# EAGLE schematic DevBoard_v0.1 (EAGLE 9.1.3)

## Sheet 1 of 11: STM32F1
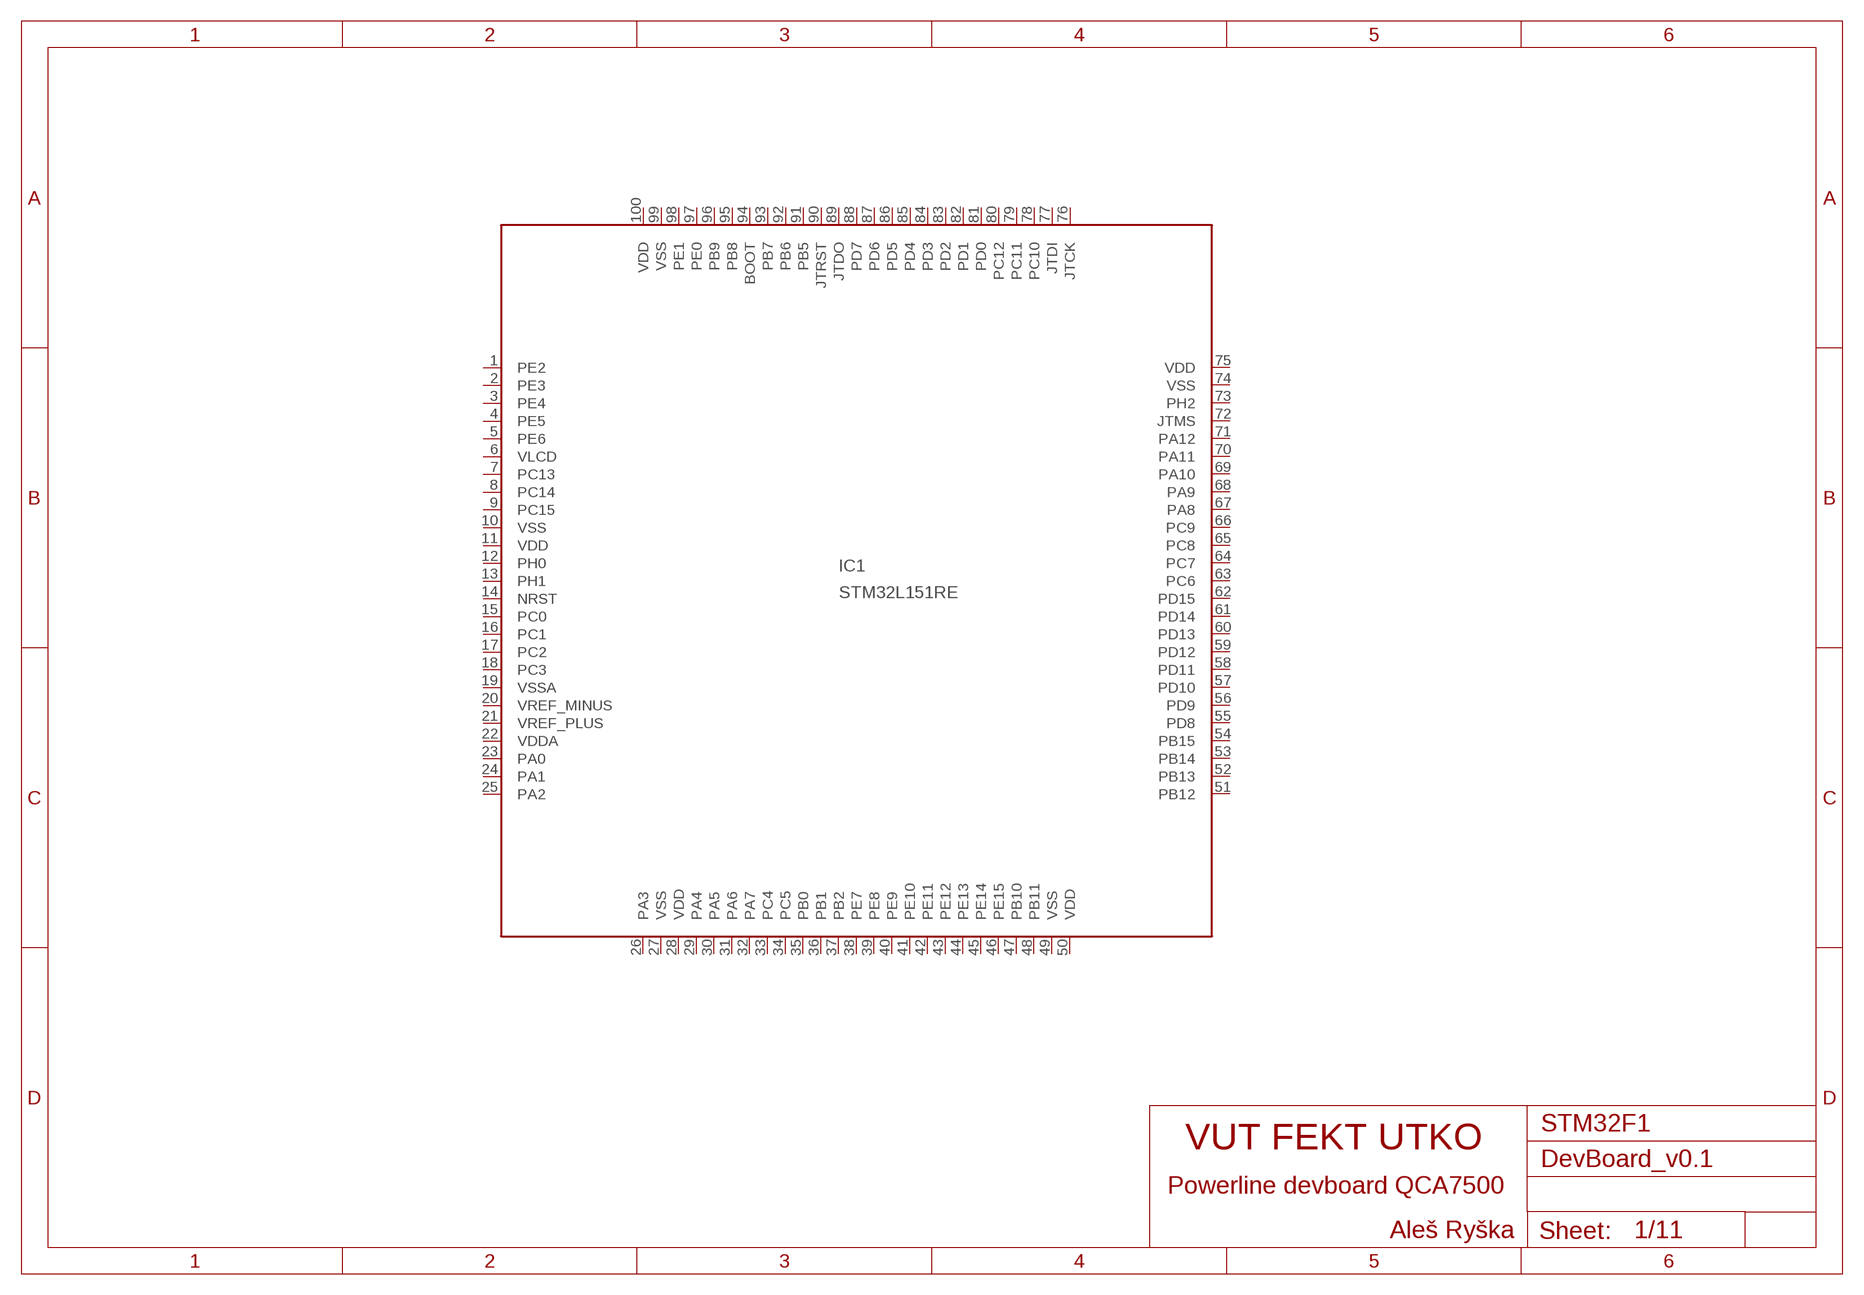
[diagram p0: schematic, sheet 1]

### Parts
IC1  STM32L151RE  [LQFP100_14X14]
Unconnected: IC1.1(PE2) IC1.2(PE3) IC1.3(PE4) IC1.4(PE5) IC1.5(PE6) IC1.6(VLCD) IC1.7(PC13) IC1.8(PC14) IC1.9(PC15) IC1.12(PH0) IC1.13(PH1) IC1.14(NRST) IC1.15(PC0) IC1.16(PC1) IC1.17(PC2) IC1.18(PC3) IC1.20(VREF_MINUS) IC1.21(VREF_PLUS) IC1.23(PA0) IC1.24(PA1) IC1.25(PA2) IC1.26(PA3) IC1.29(PA4) IC1.30(PA5) IC1.31(PA6) IC1.32(PA7) IC1.33(PC4) IC1.34(PC5) IC1.35(PB0) IC1.36(PB1) IC1.37(PB2) IC1.38(PE7) IC1.39(PE8) IC1.40(PE9) IC1.41(PE10) IC1.42(PE11) IC1.43(PE12) IC1.44(PE13) IC1.45(PE14) IC1.46(PE15) IC1.47(PB10) IC1.48(PB11) IC1.51(PB12) IC1.52(PB13) IC1.53(PB14) IC1.54(PB15) IC1.55(PD8) IC1.56(PD9) IC1.57(PD10) IC1.58(PD11) IC1.59(PD12) IC1.60(PD13) IC1.61(PD14) IC1.62(PD15) IC1.63(PC6) IC1.64(PC7) IC1.65(PC8) IC1.66(PC9) IC1.67(PA8) IC1.68(PA9) IC1.69(PA10) IC1.70(PA11) IC1.71(PA12) IC1.72(JTMS) IC1.73(PH2) IC1.76(JTCK) IC1.77(JTDI) IC1.78(PC10) IC1.79(PC11) IC1.80(PC12) IC1.81(PD0) IC1.82(PD1) IC1.83(PD2) IC1.84(PD3) IC1.85(PD4) IC1.86(PD5) IC1.87(PD6) IC1.88(PD7) IC1.89(JTDO) IC1.90(JTRST) IC1.91(PB5) IC1.92(PB6) IC1.93(PB7) IC1.94(BOOT) IC1.95(PB8) IC1.96(PB9) IC1.97(PE0) IC1.98(PE1)

### Notes on the sheet
- STM32F1
- VUT FEKT UTKO
- Powerline devboard QCA7500
- Aleš Ryška

## Sheet 2 of 11: RS485
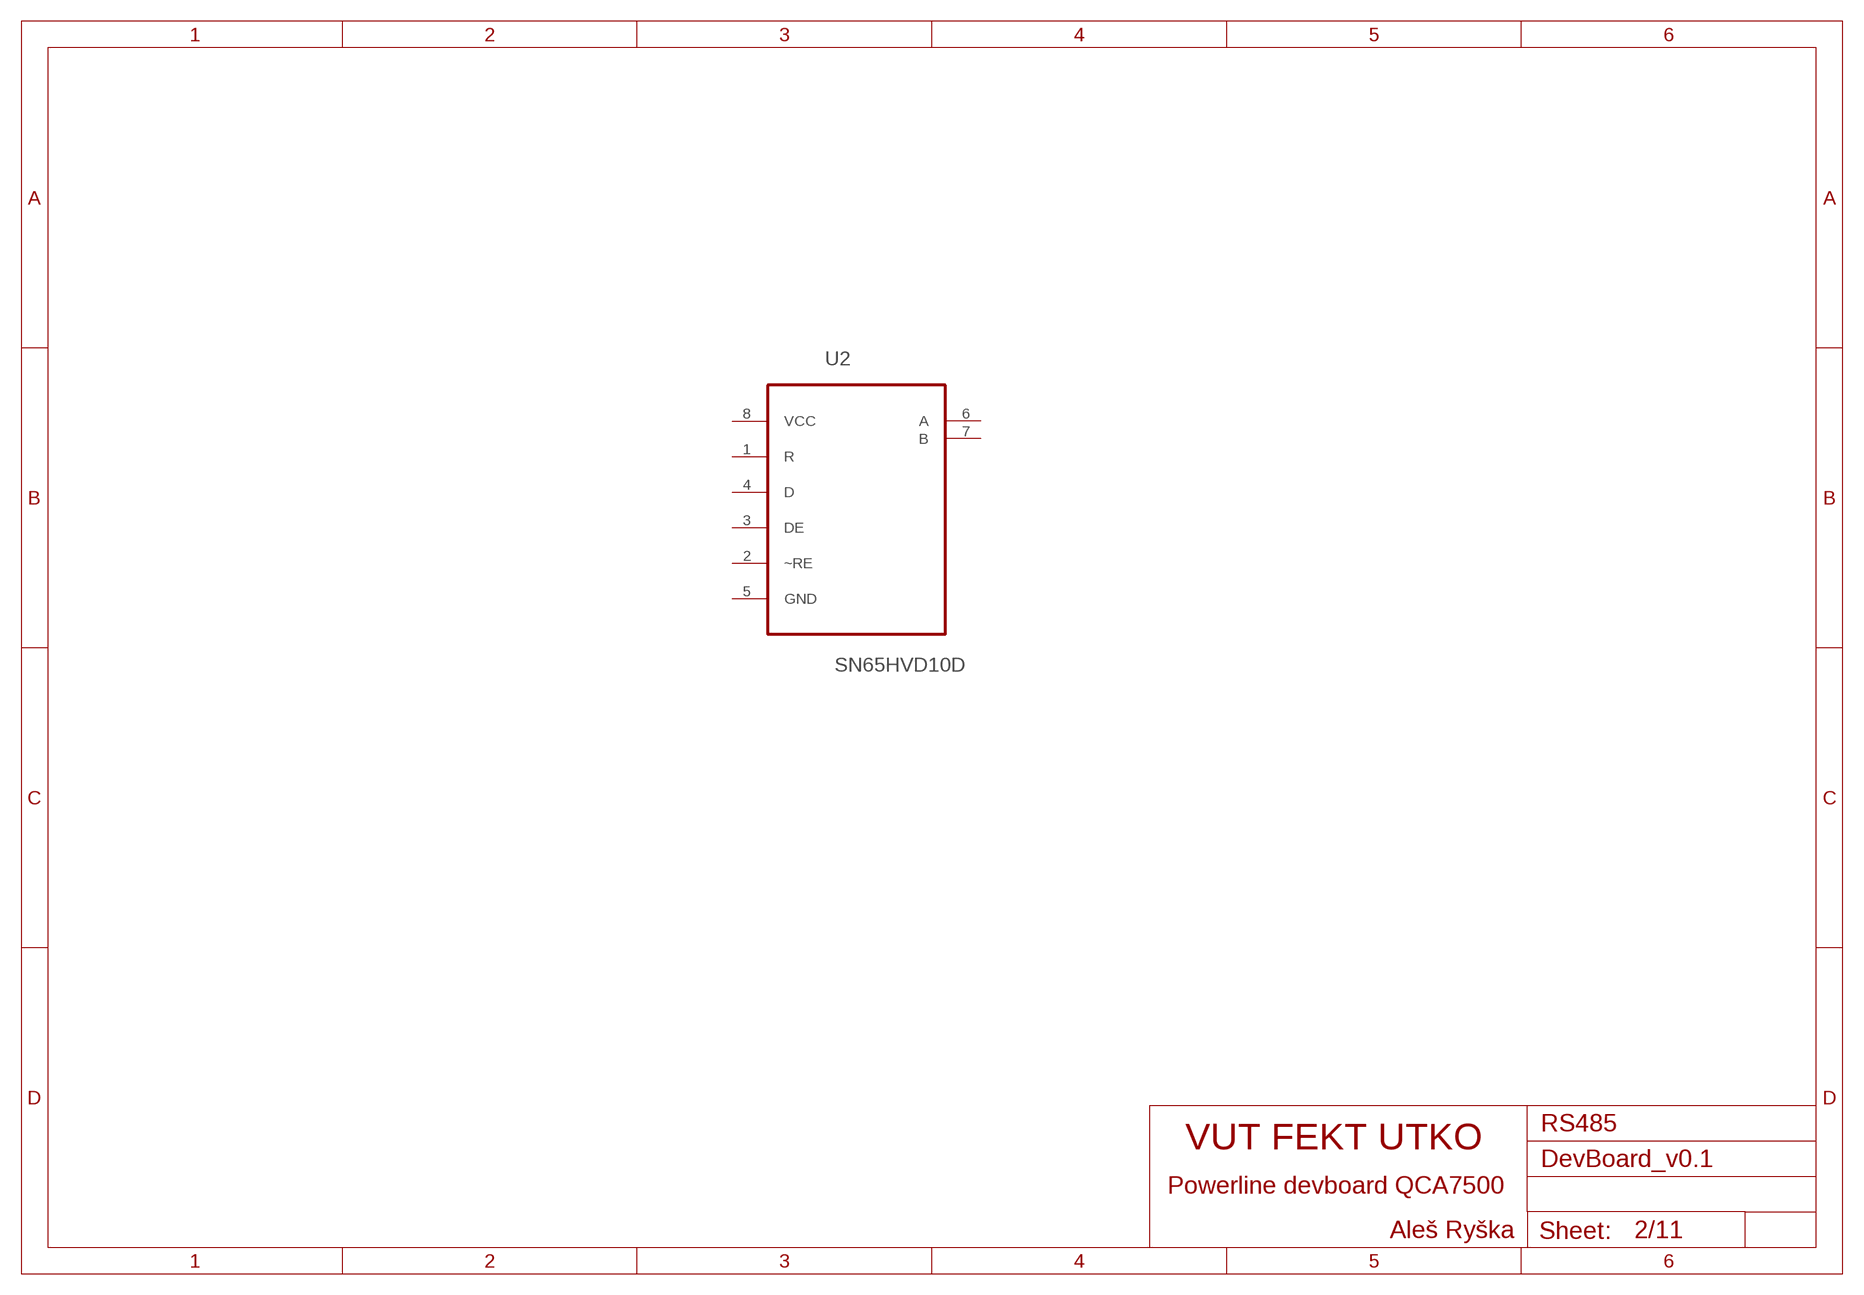
[diagram p1: schematic, sheet 2]

### Parts
U2  SN65HVD10D  [SOIC127P600X175-8N]
Unconnected: U2.1(R) U2.2(~RE) U2.3(DE) U2.4(D) U2.5(GND) U2.6(A) U2.7(B)

### Notes on the sheet
- RS485
- VUT FEKT UTKO
- Powerline devboard QCA7500
- Aleš Ryška

## Sheet 3 of 11: CAN
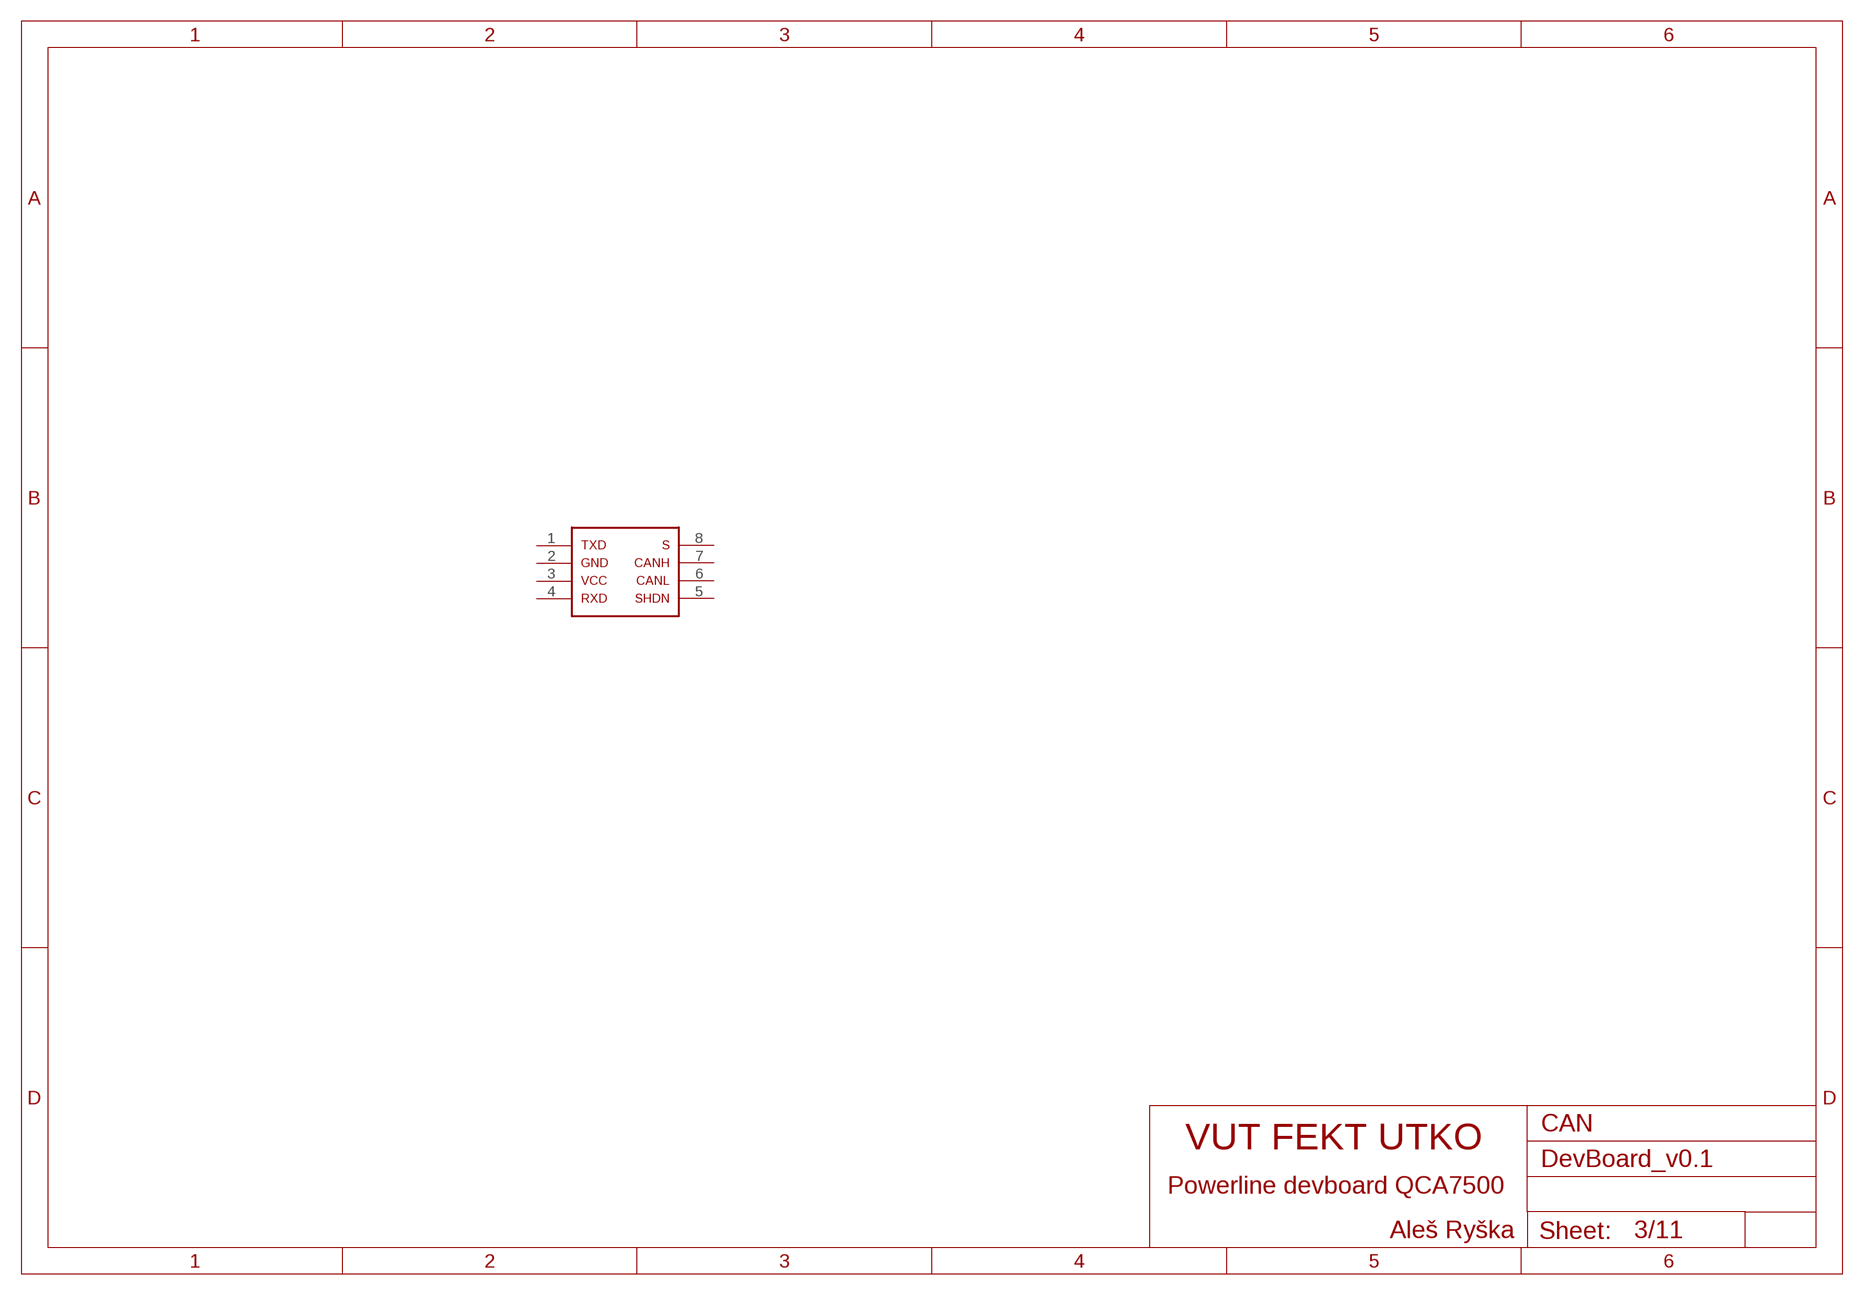
[diagram p2: schematic, sheet 3]

### Parts
U$2  TCAN330  [SOP65P280X145-8N]
Unconnected: U$2.1(TXD) U$2.2 U$2.3 U$2.4(RXD) U$2.5(SHDN) U$2.6(CANL) U$2.7(CANH) U$2.8(S)

### Notes on the sheet
- CAN
- VUT FEKT UTKO
- Powerline devboard QCA7500
- Aleš Ryška

## Sheet 4 of 11: GPIO & SW
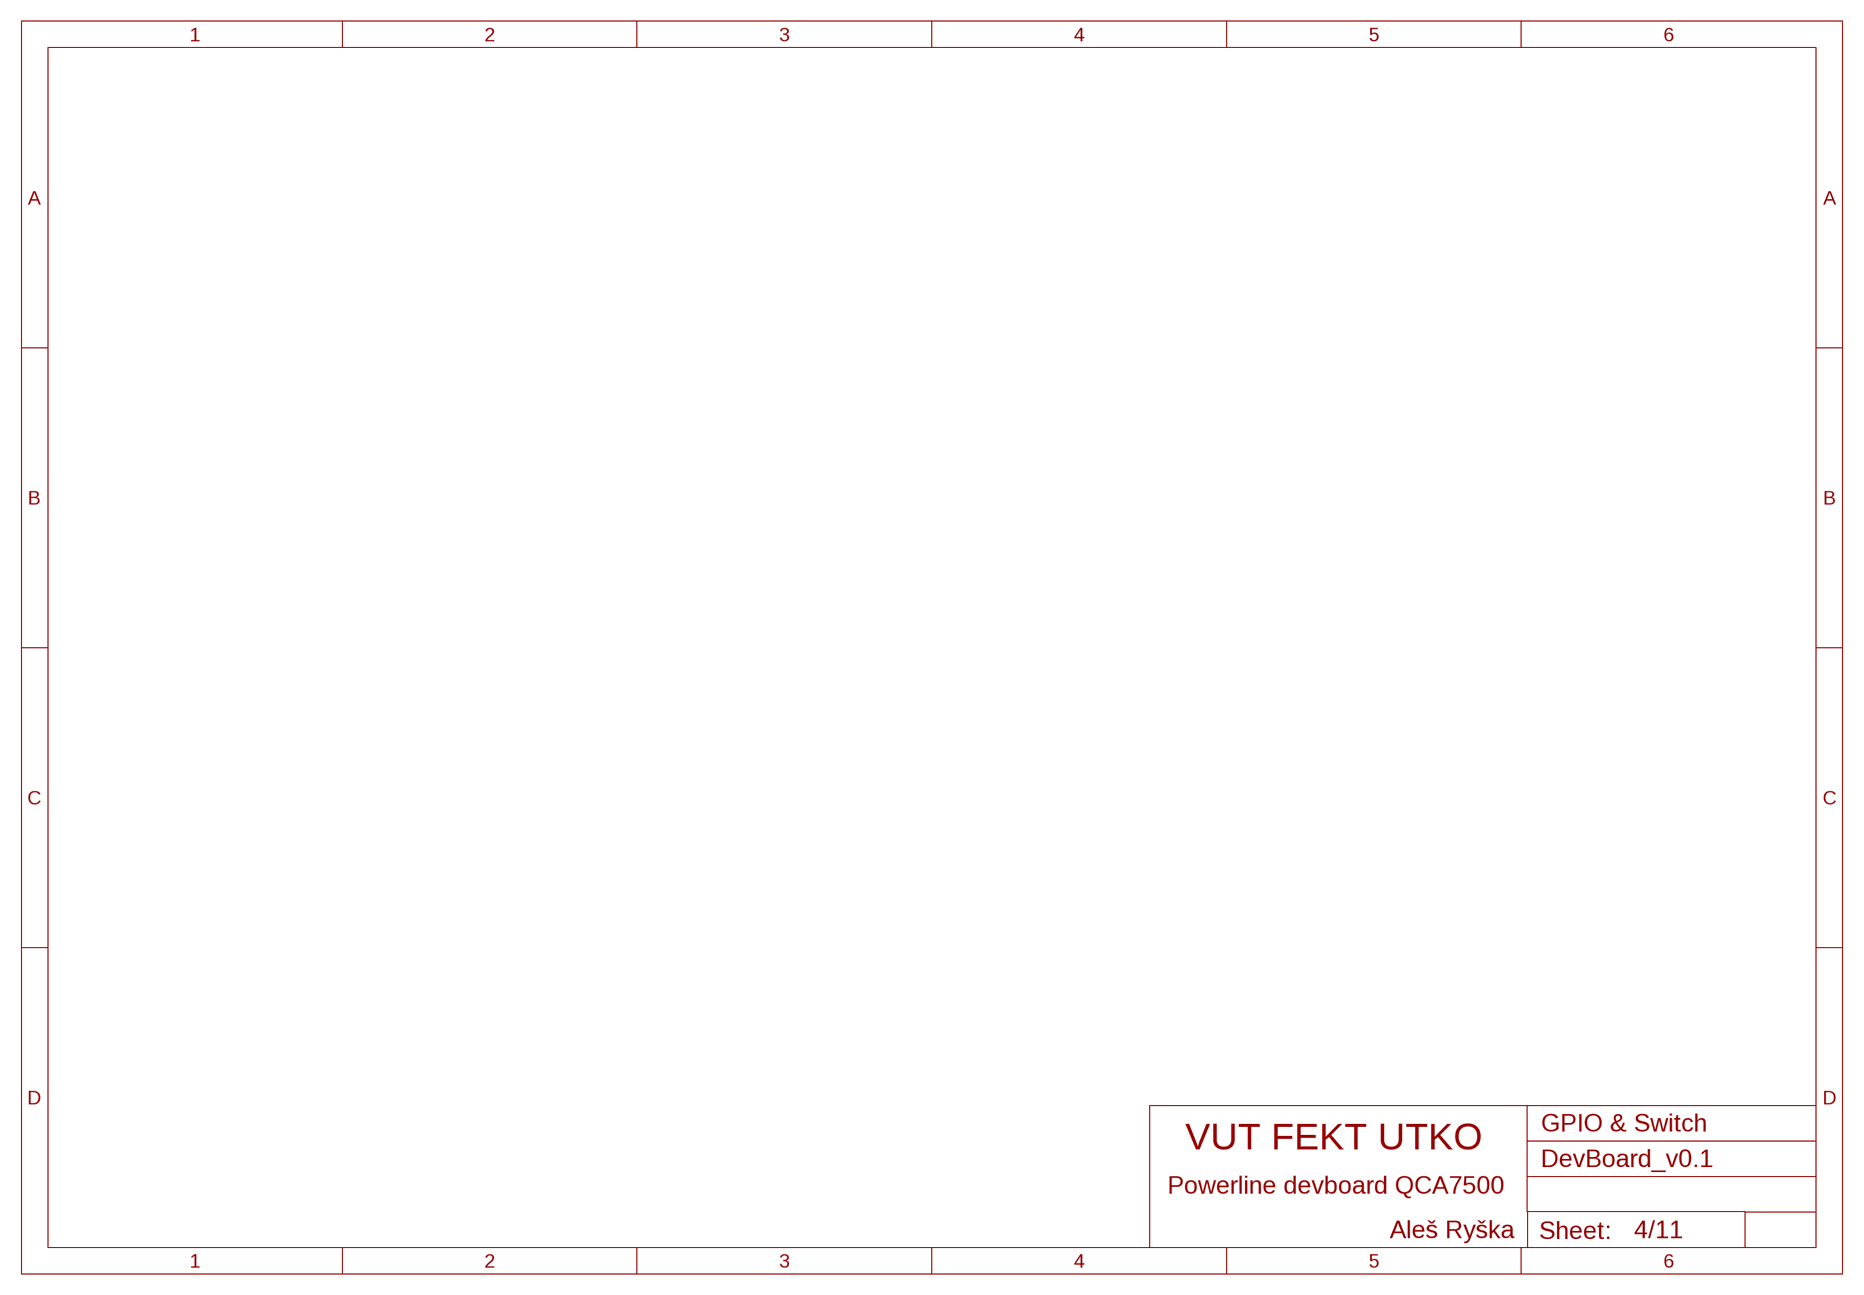
[diagram p3: schematic, sheet 4]

### Notes on the sheet
- GPIO & Switch
- VUT FEKT UTKO
- Powerline devboard QCA7500
- Aleš Ryška

## Sheet 5 of 11: Supply
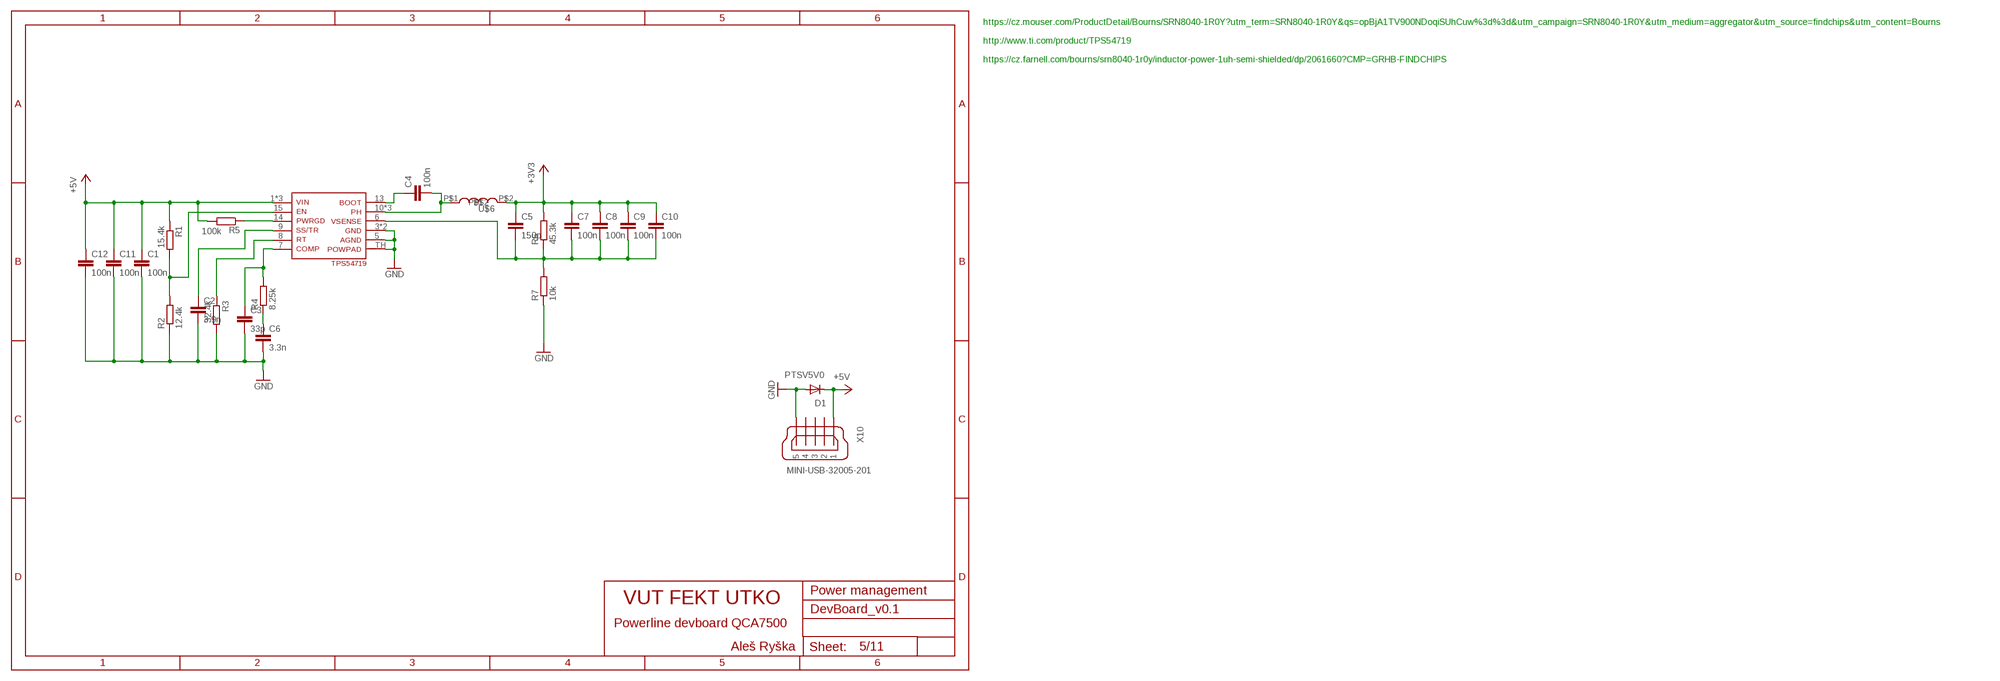
[diagram p4: schematic, sheet 5]

### Parts
C1  100n  C-EUC0805  [C0805]
C2  3.9n  C-EUC0805  [C0805]
C3  33p  C-EUC0805  [C0805]
C4  100n  C-EUC0805  [C0805]
C5  150p  C-EUC0805  [C0805]
C6  3.3n  C-EUC0805  [C0805]
C7  100n  C-EUC0805  [C0805]
C8  100n  C-EUC0805  [C0805]
C9  100n  C-EUC0805  [C0805]
C10  100n  C-EUC0805  [C0805]
C11  100n  C-EUC0805  [C0805]
C12  100n  C-EUC0805  [C0805]
D1  PTSV5V0  DIODE-SOD123  [SOD123]
R1  15.4k  R-EU_R0603  [R0603]
R2  12.4k  R-EU_R0603  [R0603]
R3  32.4k  R-EU_R0603  [R0603]
R4  8.25k  R-EU_R0603  [R0603]
R5  100k  R-EU_R0603  [R0603]
R6  45.3k  R-EU_R0603  [R0603]
R7  10k  R-EU_R0603  [R0603]
U$3  TPS54719  [QFN16]
U$6  1u  SRN8040  [SRN8040]
X10  MINI-USB-32005-201  [32005-201]

### Nets
+3V3: C5.1 C7.1 C8.1 C9.1 C10.1 R6.2 U$6.P$2 ; also sheet 6
+5V: C1.1 C11.1 C12.1 D1.C R1.1 R5.2 U$3.1(V_IN) U$3.2(V_IN) U$3.16(V_IN) X10.1
GND: C1.2 C2.2 C3.2 C6.2 C11.2 C12.2 D1.A R2.1 R3.2 R7.1 U$3.3(GND) U$3.4(GND) U$3.5(AGND) U$3.TH(PPAD) X10.5 ; also sheet 6,11
N$2: R1.2 R2.2 U$3.15(EN)
N$3: C2.1 U$3.9(SS/TR)
N$4: R3.1 U$3.8(RT)
N$5: C3.1 R4.2 U$3.7(COMP)
N$6: R5.1 U$3.14(PWRGD)
N$7: C6.1 R4.1
N$8: C4.1 U$3.13(BOOT)
N$9: C4.2 U$3.10(PH) U$3.11(PH) U$3.12(PH) U$6.P$1
N$12: C5.2 C7.2 C8.2 C9.2 C10.2 R6.1 R7.2 U$3.6(VSNS)
Unconnected: X10.2 X10.3 X10.4

### Notes on the sheet
- https://cz.mouser.com/ProductDetail/Bourns/SRN8040-1R0Y?utm_term=SRN8040-1R0Y&qs=opBjA1TV900NDoqiSUhCuw%3d%3d&utm_campaign=SRN8040-1R0Y&utm_medium=aggregator&utm_source=findchips&utm_content=Bourns
- http://www.ti.com/product/TPS54719
- https://cz.farnell.com/bourns/srn8040-1r0y/inductor-power-1uh-semi-shielded/dp/2061660?CMP=GRHB-FINDCHIPS
- Power management
- VUT FEKT UTKO
- Powerline devboard QCA7500
- Aleš Ryška

## Sheet 6 of 11: Jalapeno
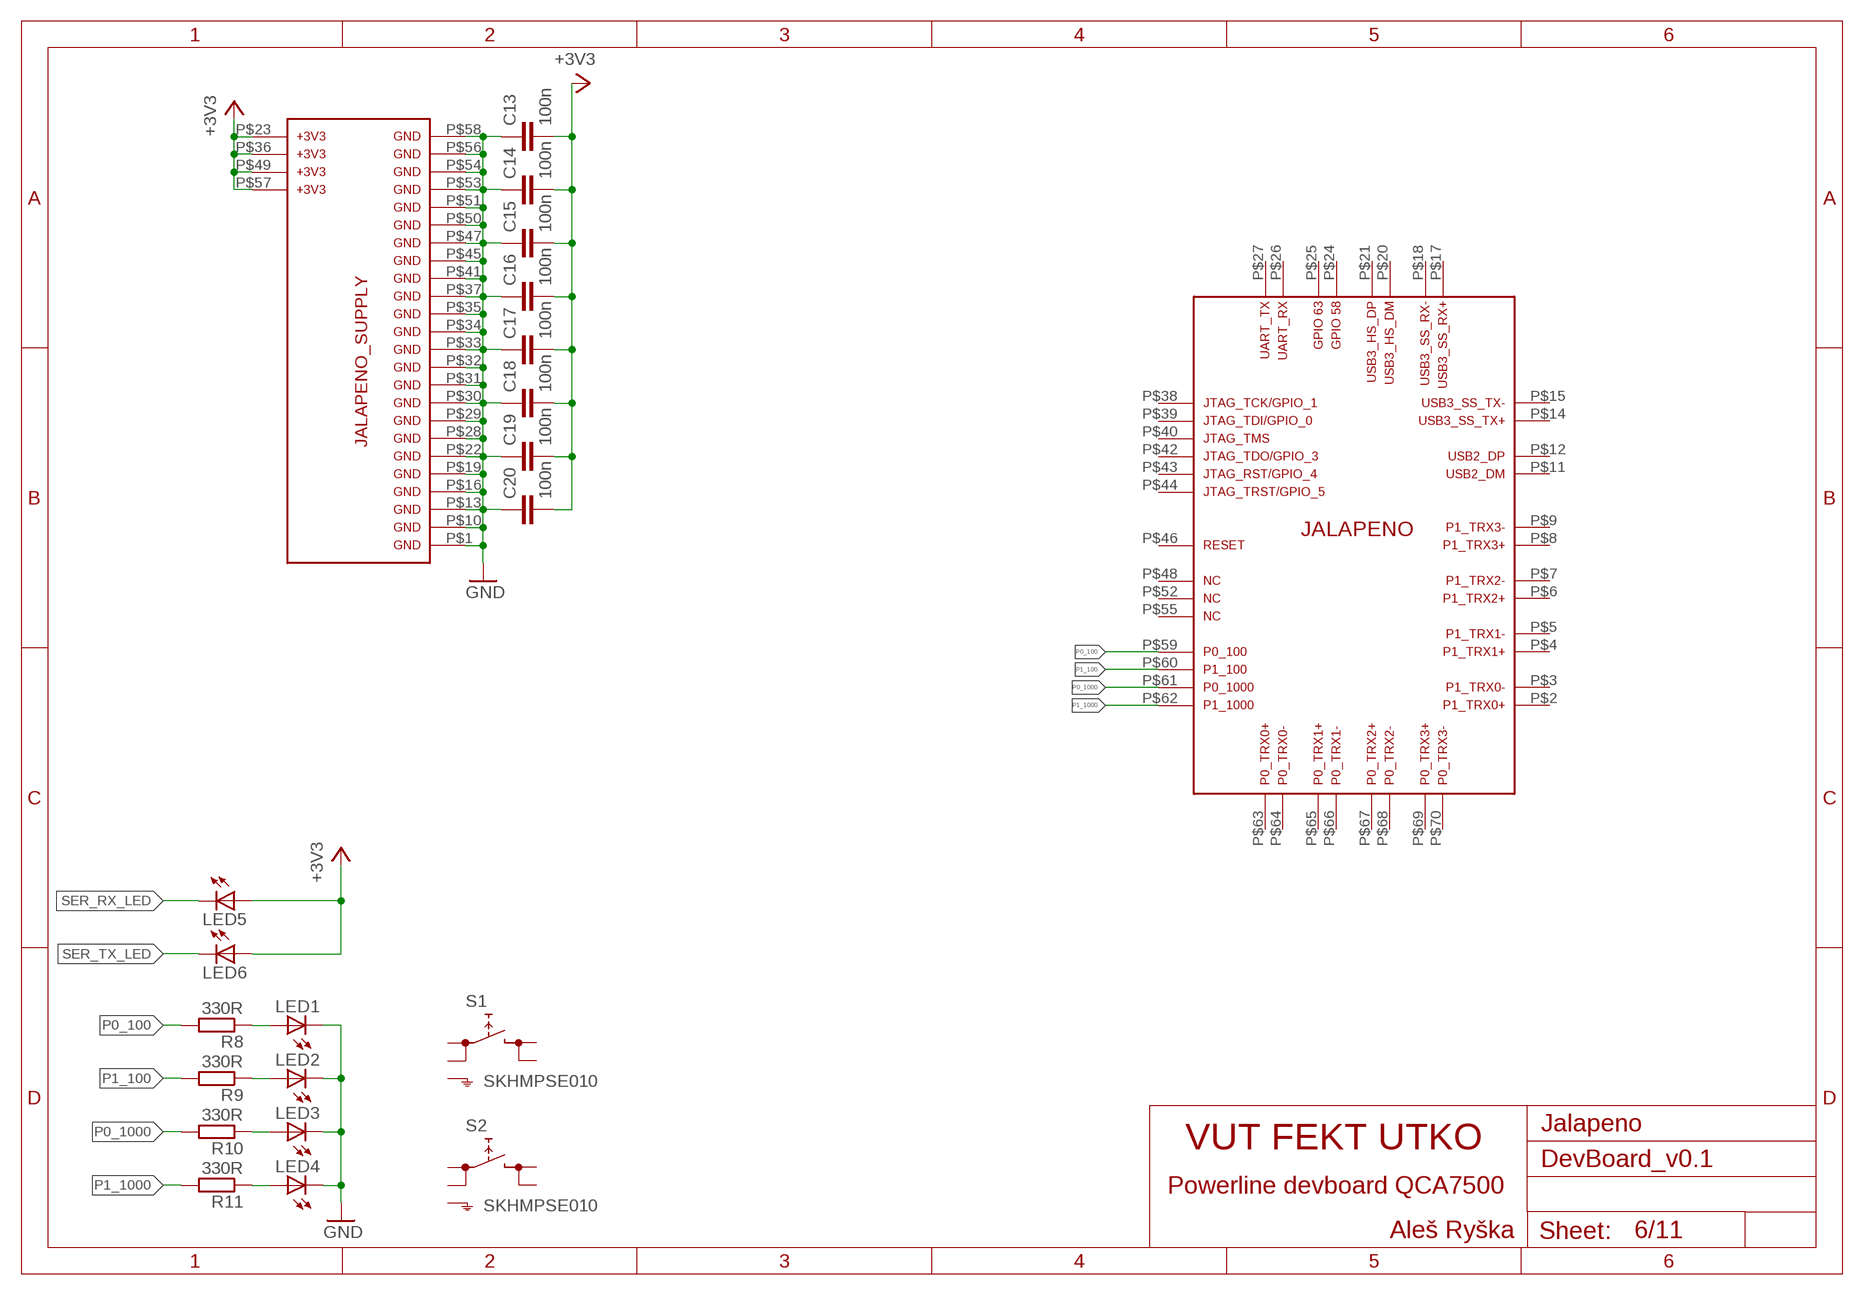
[diagram p5: schematic, sheet 6]

### Parts
C13  100n  C-EUC0805  [C0805]
C14  100n  C-EUC0805  [C0805]
C15  100n  C-EUC0805  [C0805]
C16  100n  C-EUC0805  [C0805]
C17  100n  C-EUC0805  [C0805]
C18  100n  C-EUC0805  [C0805]
C19  100n  C-EUC0805  [C0805]
C20  100n  C-EUC0805  [C0805]
LED1  LED_E  [LED_1206]
LED2  LED_E  [LED_1206]
LED3  LED_E  [LED_1206]
LED4  LED_E  [LED_1206]
LED5  LED_E  [LED_1206]
LED6  LED_E  [LED_1206]
R8  330R  R-EU_R0603  [R0603]
R9  330R  R-EU_R0603  [R0603]
R10  330R  R-EU_R0603  [R0603]
R11  330R  R-EU_R0603  [R0603]
S1  SKHMPSE010  [SKHMPXE010]
S2  SKHMPSE010  [SKHMPXE010]
U$1  JALAPENO  [JALAPENO]

### Nets
+3V3: C13.2 C14.2 C15.2 C16.2 C17.2 C18.2 C19.2 C20.2 LED5.A LED6.A U$1.P$23 U$1.P$36 U$1.P$49 U$1.P$57 ; also sheet 5
GND: C13.1 C14.1 C15.1 C16.1 C17.1 C18.1 C19.1 C20.1 LED1.C LED2.C LED3.C LED4.C U$1.P$1 U$1.P$10 U$1.P$13 U$1.P$16 U$1.P$19 U$1.P$22 U$1.P$28 U$1.P$29 U$1.P$30 U$1.P$31 U$1.P$32 U$1.P$33 U$1.P$34 U$1.P$35 U$1.P$37 U$1.P$41 U$1.P$45 U$1.P$47 U$1.P$50 U$1.P$51 U$1.P$53 U$1.P$54 U$1.P$56 U$1.P$58 ; also sheet 5,11
N$10: LED1.A R8.1
N$11: LED2.A R9.1
N$13: LED3.A R10.1
N$14: LED4.A R11.1
P0_100: R8.2 U$1.P$59(P0_100)
P0_1000: R10.2 U$1.P$61(P0_1000)
P1_100: R9.2 U$1.P$60(P1_100)
P1_1000: R11.2 U$1.P$62(P1_1000)
SER_RX_LED: LED5.C
SER_TX_LED: LED6.C
Unconnected: S1.1(1.1) S1.2(1.2) S1.3(2.1) S1.4(2.2) S1.5(SH) S2.1(1.1) S2.2(1.2) S2.3(2.1) S2.4(2.2) S2.5(SH) U$1.P$2(P1_TRX0_P) U$1.P$3(P1_TRX0_N) U$1.P$4(P1_TRX1_P) U$1.P$5(P1_TRX1_N) U$1.P$6(P1_TRX2_P) U$1.P$7(P1_TRX2_N) U$1.P$8(P1_TRX3_P) U$1.P$9(P1_TRX3_N) U$1.P$11(USB2_DM) U$1.P$12(USB2_DP) U$1.P$14(USB3_SS_TX_P) U$1.P$15(USB3_SS_TX_N) U$1.P$17(USB3_SS_RX_P) U$1.P$18(USB3_SS_RX_N) U$1.P$20(USB3_HS_DM) U$1.P$21(USB3_HS_DP) U$1.P$24(GPIO_58) U$1.P$25(GPIO_63) U$1.P$26(UART_RX) U$1.P$27(UART_TX) U$1.P$38(JTAG_TCK) U$1.P$39(JTAG_TDI) U$1.P$40(JTAG_TMS) U$1.P$42(JTAG_TDO) U$1.P$43(JTAG_RST_N) U$1.P$44(JTAG_TRST_N) U$1.P$46(CHIP_PWD_L) U$1.P$48 U$1.P$52 U$1.P$55 U$1.P$63(P0_TRX0_P) U$1.P$64(P0_TRX0_N) U$1.P$65(P0_TRX1_P) U$1.P$66(P0_TRX1_N) U$1.P$67(P0_TRX2_P) U$1.P$68(P0_TRX2_N) U$1.P$69(P0_TRX3_P) U$1.P$70(P0_TRX3_N)

### Notes on the sheet
- Jalapeno
- VUT FEKT UTKO
- Powerline devboard QCA7500
- Aleš Ryška

## Sheet 7 of 11: Gigabit transciever
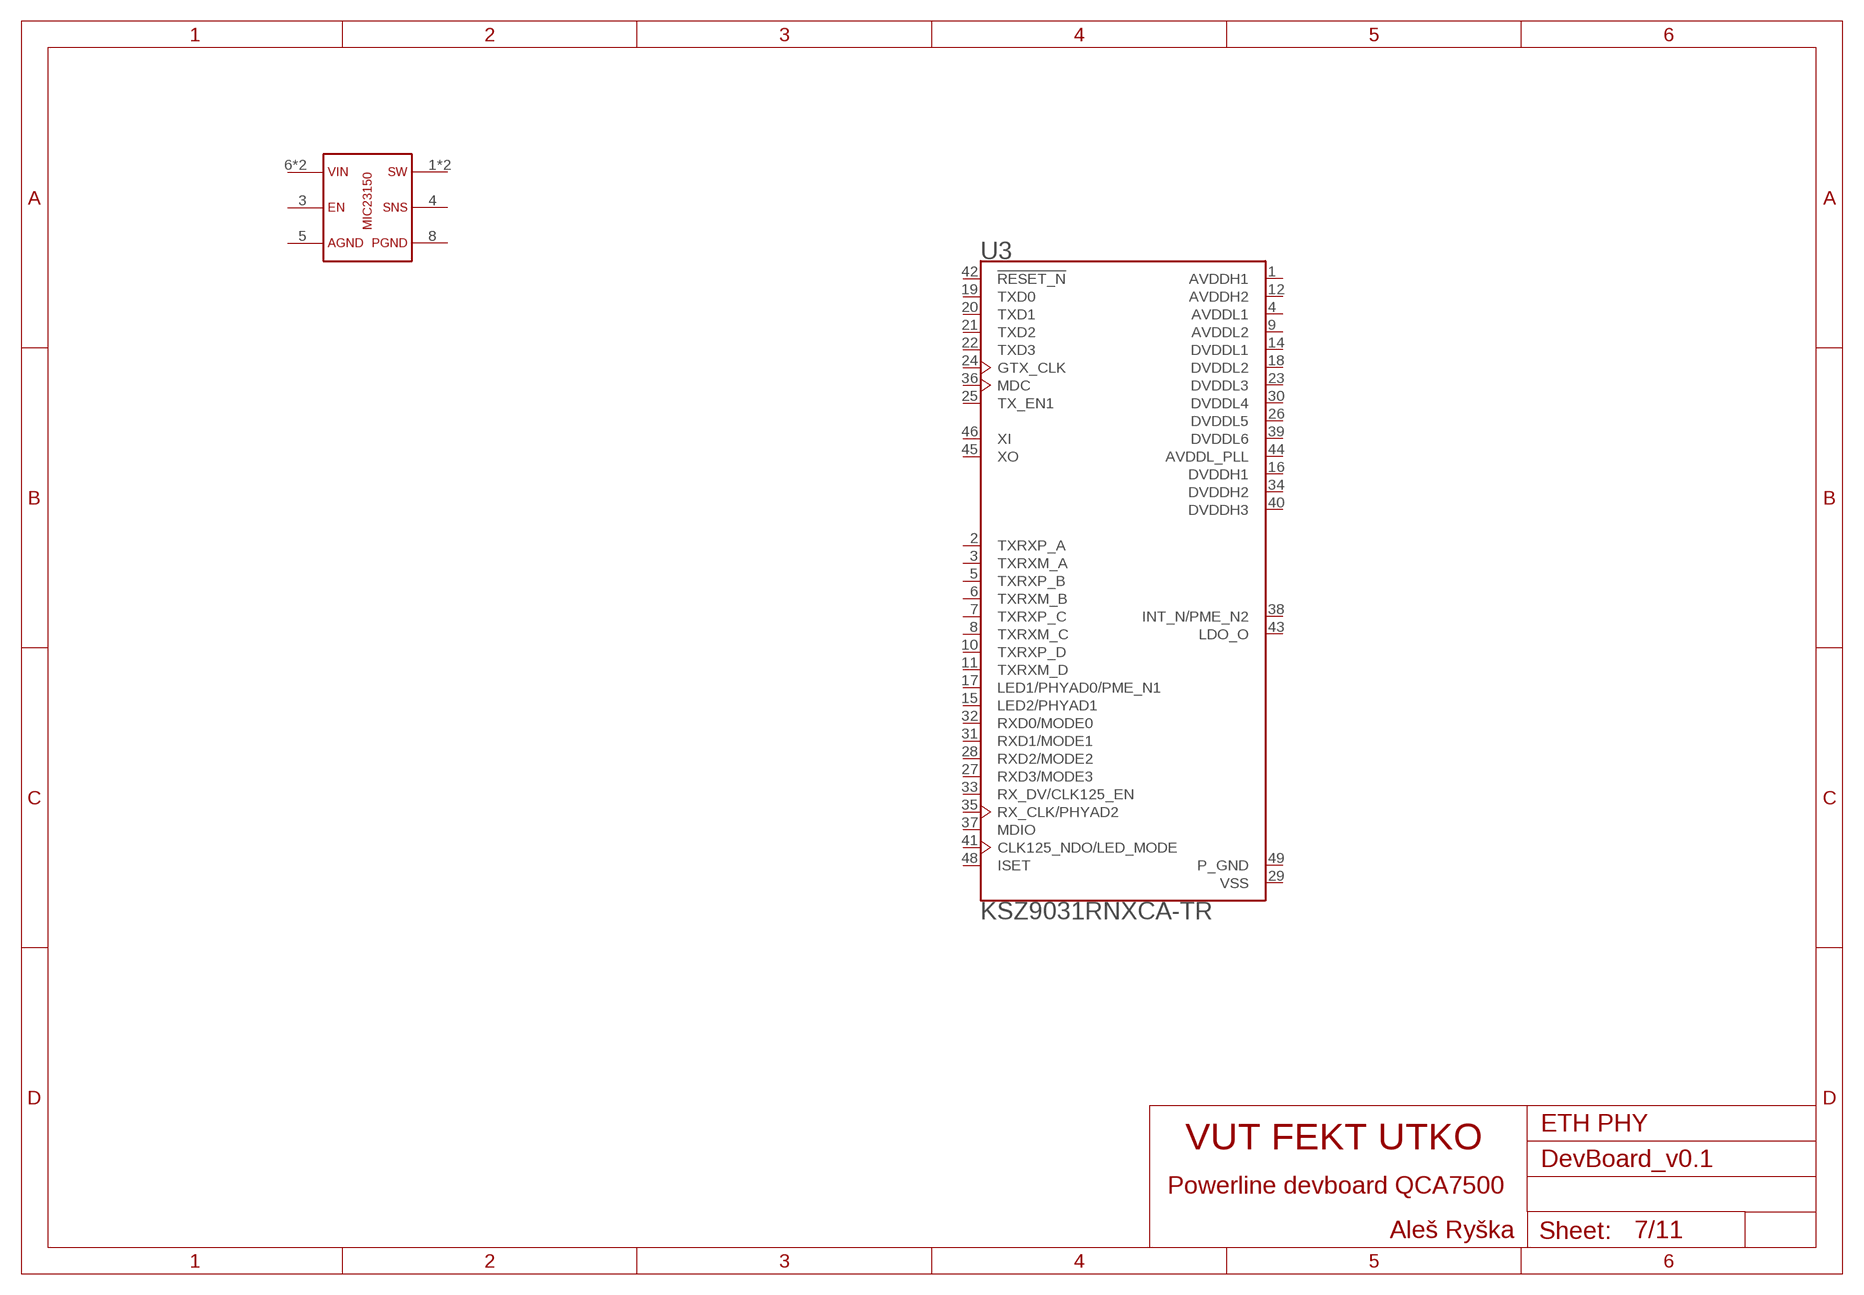
[diagram p6: schematic, sheet 7]

### Parts
U3  KSZ9031RNXCA-TR  [QFN50P700X700X90-49N]
U$5  MIC23150  [DFN8G-0.5-2X2MM]
Unconnected: U3.2(TXRXP_A) U3.3(TXRXM_A) U3.5(TXRXP_B) U3.6(TXRXM_B) U3.7(TXRXP_C) U3.8(TXRXM_C) U3.10(TXRXP_D) U3.11(TXRXM_D) U3.15(LED2/PHYAD1) U3.17(LED1/PHYAD0/PME_N1) U3.19(TXD0) U3.20(TXD1) U3.21(TXD2) U3.22(TXD3) U3.24(GTX_CLK) U3.25(TX_EN1) U3.27(RXD3/MODE3) U3.28(RXD2/MODE2) U3.31(RXD1/MODE1) U3.32(RXD0/MODE0) U3.33(RX_DV/CLK125_EN) U3.35(RX_CLK/PHYAD2) U3.36(MDC) U3.37(MDIO) U3.38(INT_N/PME_N2) U3.41(CLK125_NDO/LED_MODE) U3.42(!RESET_N) U3.43(LDO_O) U3.45(XO) U3.46(XI) U3.48(ISET) U$5.1 U$5.2 U$5.3 U$5.4 U$5.5 U$5.6 U$5.7 U$5.8

### Notes on the sheet
- ETH PHY
- VUT FEKT UTKO
- Powerline devboard QCA7500
- Aleš Ryška

## Sheet 8 of 11: QCA7500
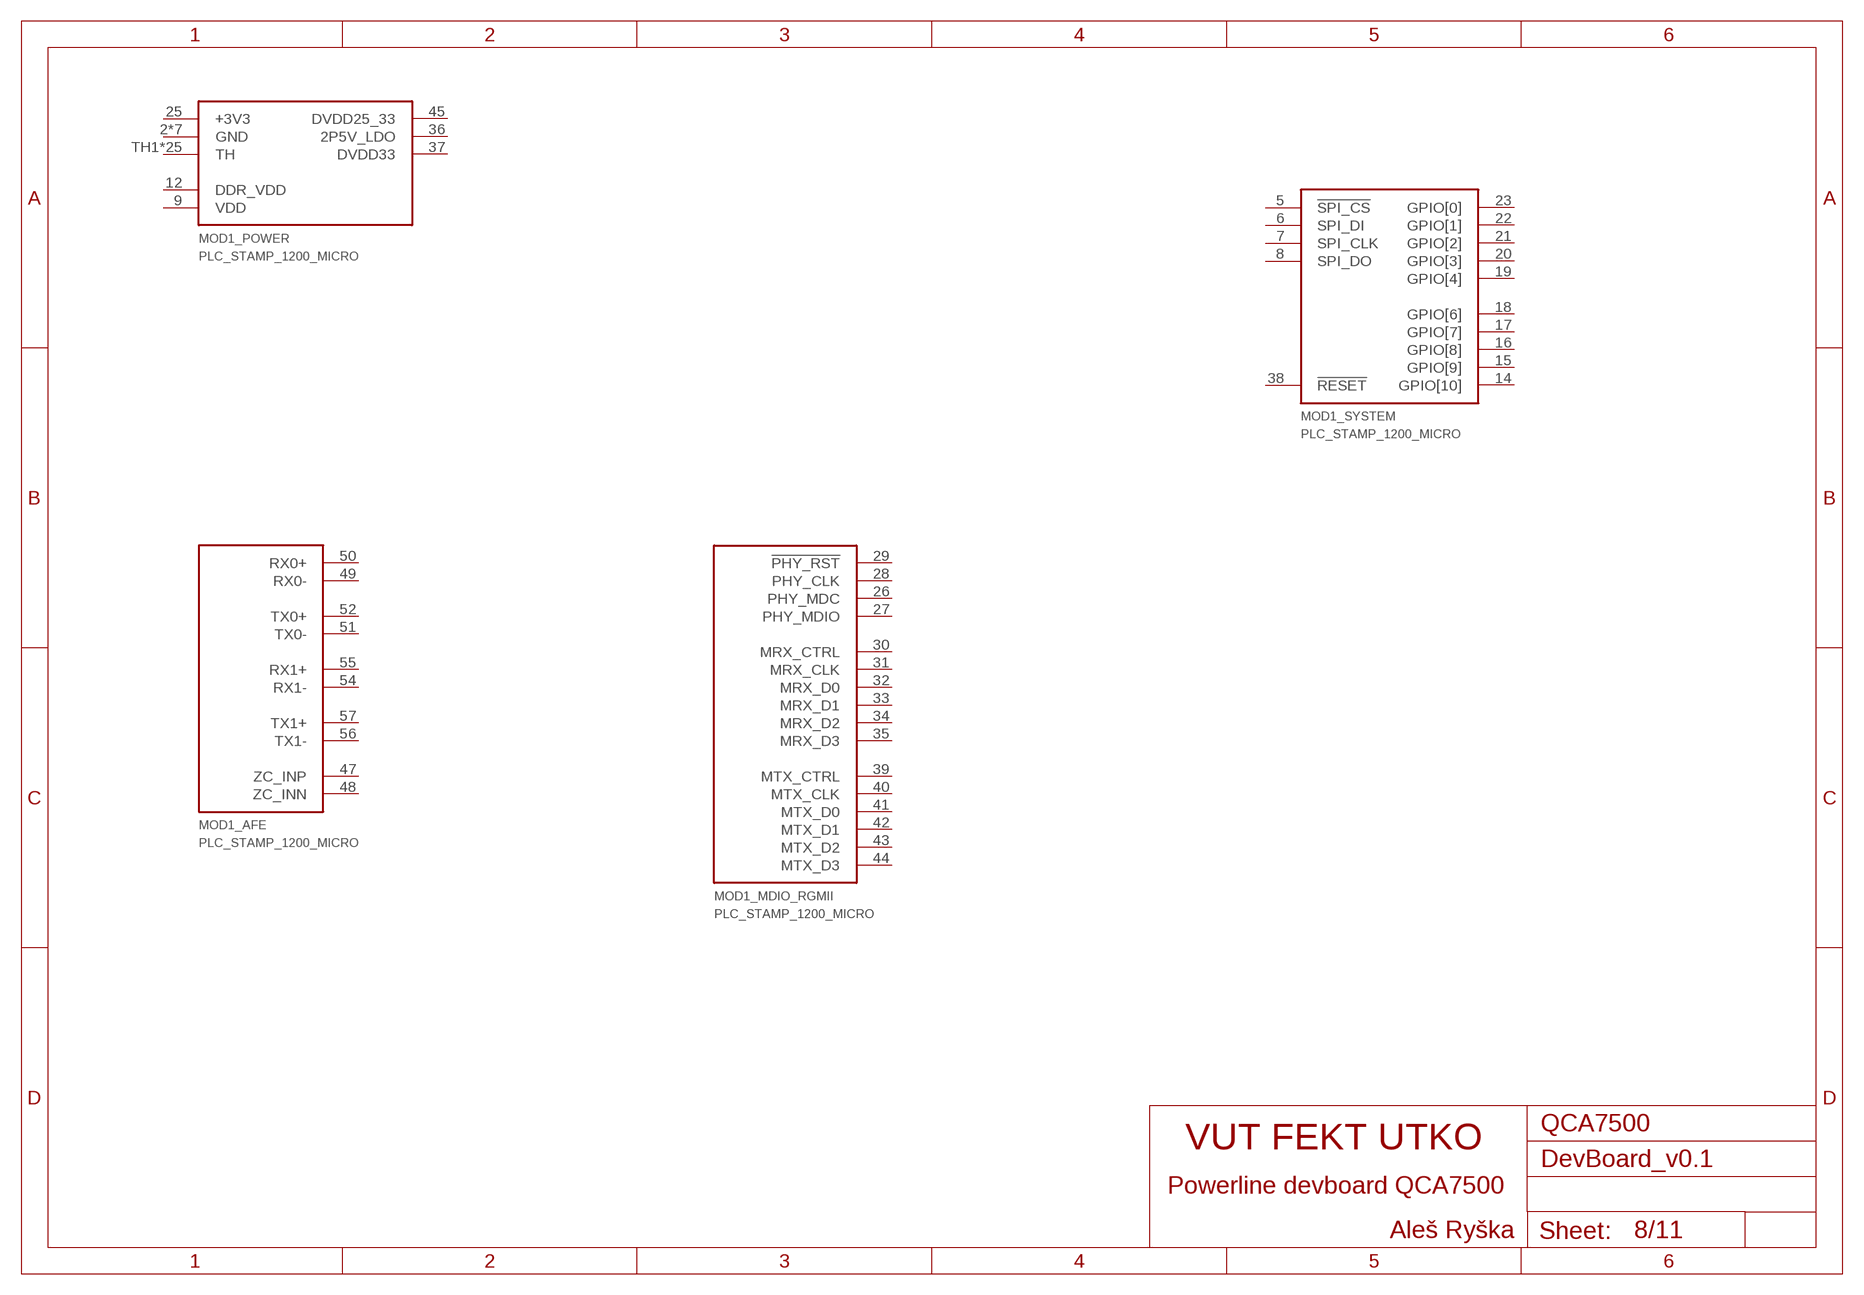
[diagram p7: schematic, sheet 8]

### Parts
MOD1  PLC_STAMP_1200_MICRO  [PLC_STAMP_1200_MICRO]
Unconnected: MOD1.5(_SYSTEM:!SPI_CS) MOD1.6(_SYSTEM:SPI_DI) MOD1.7(_SYSTEM:SPI_CLK) MOD1.8(_SYSTEM:SPI_DO) MOD1.14(_SYSTEM:GPIO[10]) MOD1.15(_SYSTEM:GPIO[9]) MOD1.16(_SYSTEM:GPIO[8]) MOD1.17(_SYSTEM:GPIO[7]) MOD1.18(_SYSTEM:GPIO[6]) MOD1.19(_SYSTEM:GPIO[4]) MOD1.20(_SYSTEM:GPIO[3]) MOD1.21(_SYSTEM:GPIO[2]) MOD1.22(_SYSTEM:GPIO[1]) MOD1.23(_SYSTEM:GPIO[0]) MOD1.26(_MDIO_RGMII:PHY_MDC) MOD1.27(_MDIO_RGMII:PHY_MDIO) MOD1.28(_MDIO_RGMII:PHY_CLK) MOD1.29(_MDIO_RGMII:!PHY_RST) MOD1.30(_MDIO_RGMII:MRX_CTRL) MOD1.31(_MDIO_RGMII:MRX_CLK) MOD1.32(_MDIO_RGMII:MRX_D0) MOD1.33(_MDIO_RGMII:MRX_D1) MOD1.34(_MDIO_RGMII:MRX_D2) MOD1.35(_MDIO_RGMII:MRX_D3) MOD1.36(_POWER:2P5V_LDO) MOD1.37(_POWER:DVDD33) MOD1.38(_SYSTEM:!RESET) MOD1.39(_MDIO_RGMII:MTX_CTRL) MOD1.40(_MDIO_RGMII:MTX_CLK) MOD1.41(_MDIO_RGMII:MTX_D0) MOD1.42(_MDIO_RGMII:MTX_D1) MOD1.43(_MDIO_RGMII:MTX_D2) MOD1.44(_MDIO_RGMII:MTX_D3) MOD1.47(_AFE:ZC_INP) MOD1.48(_AFE:ZC_INN) MOD1.49(_AFE:RX0-) MOD1.50(_AFE:RX0+) MOD1.51(_AFE:TX0-) MOD1.52(_AFE:TX0+) MOD1.54(_AFE:RX1-) MOD1.55(_AFE:RX1+) MOD1.56(_AFE:TX1-) MOD1.57(_AFE:TX1+)

### Notes on the sheet
- QCA7500
- VUT FEKT UTKO
- Powerline devboard QCA7500
- Aleš Ryška

## Sheet 9 of 11: Interfaces
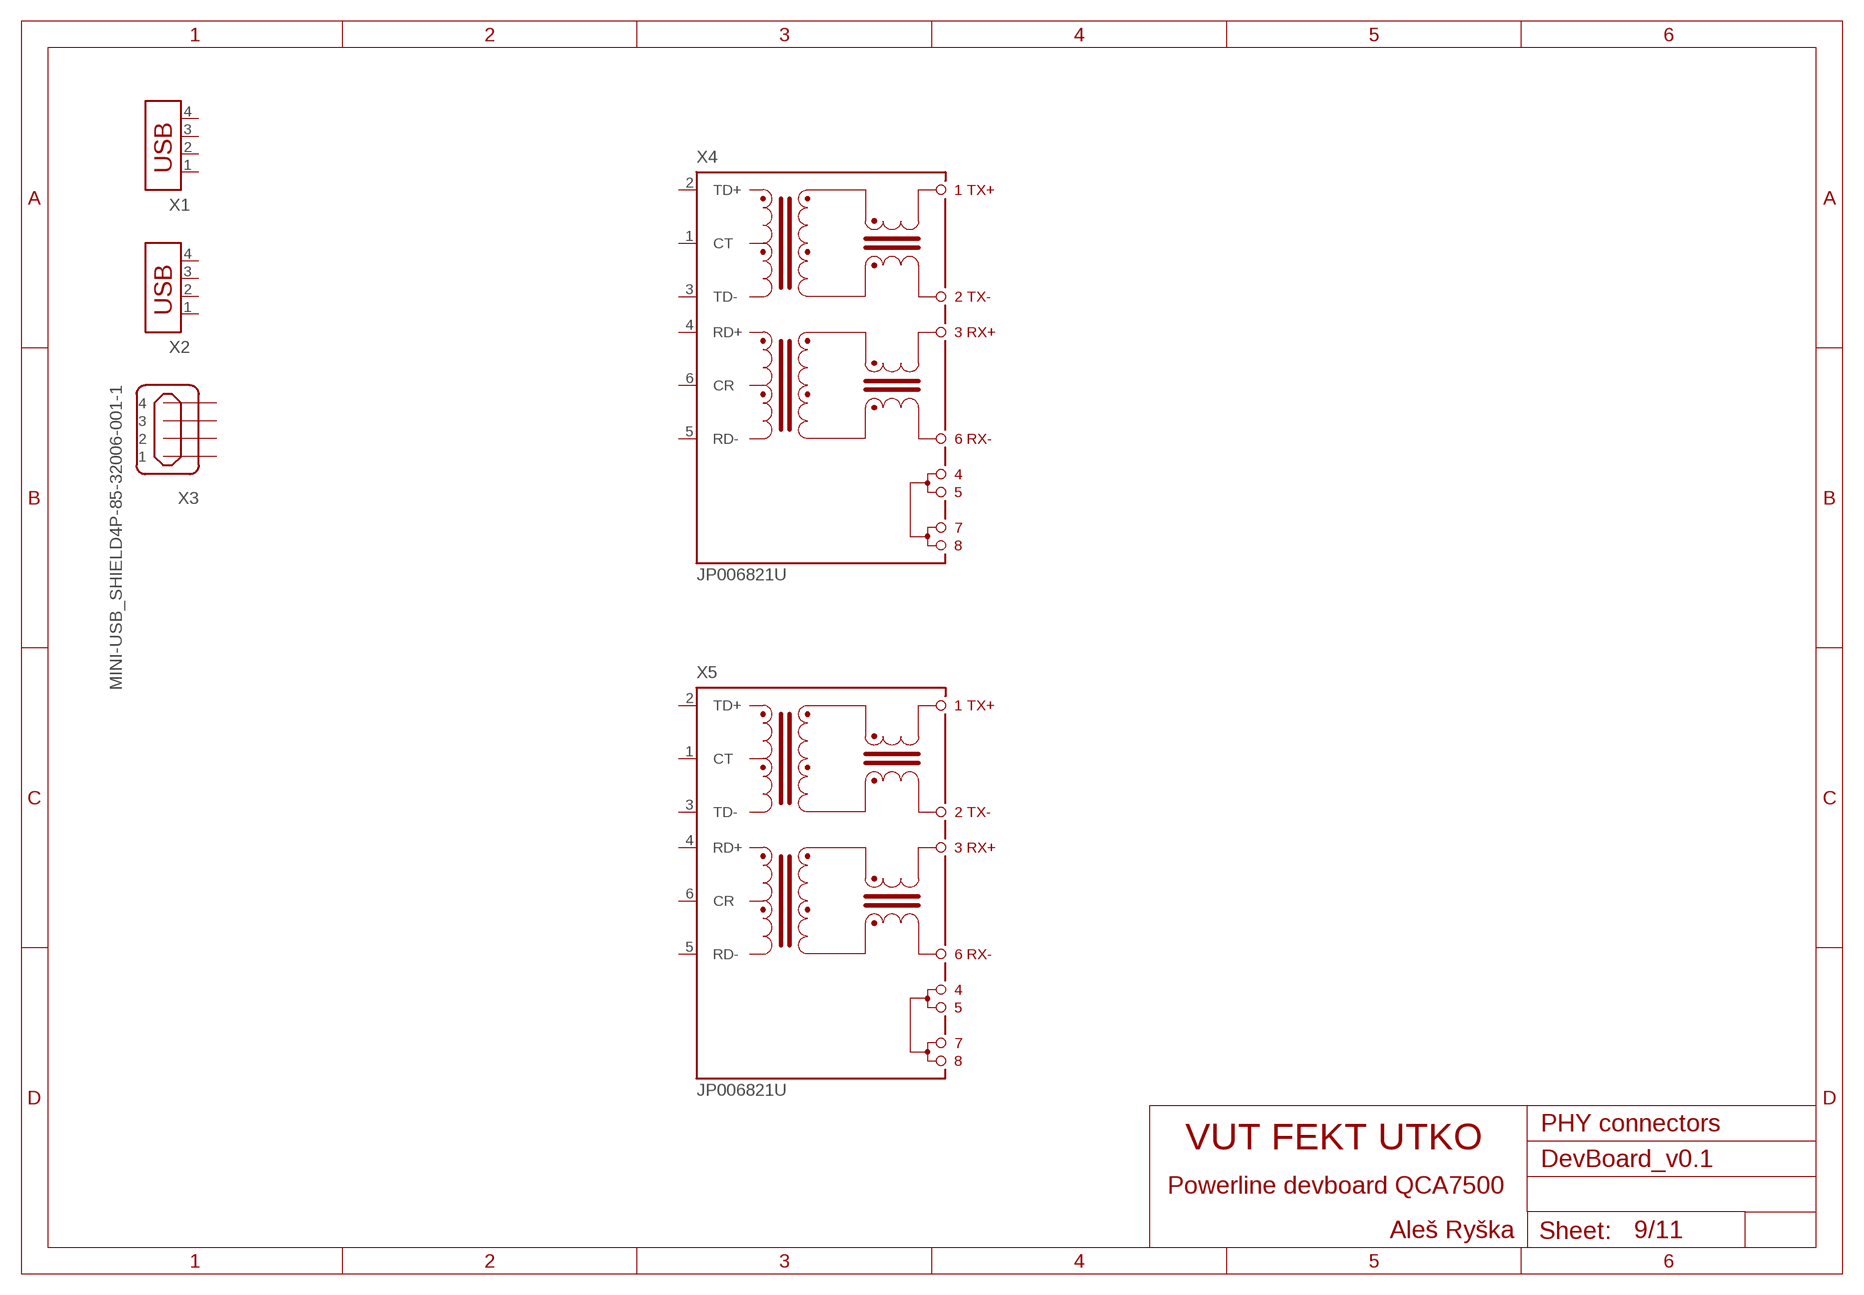
[diagram p8: schematic, sheet 9]

### Parts
X1  USB-787616  [USB]
X2  USB-787616  [USB]
X3  MINI-USB_SHIELD4P-85-32006-001-1  [85-32006-001-1]
X4  JP006821U  [JP]
X5  JP006821U  [JP]
Unconnected: X1.1 X1.2 X1.3 X1.4 X2.1 X2.2 X2.3 X2.4 X3.1 X3.2 X3.3 X3.4 X3.M1(S1) X3.M2(S2) X4.1(CT) X4.2(TD+) X4.3(TD-) X4.4(RD+) X4.5(RD-) X4.6(CR) X5.1(CT) X5.2(TD+) X5.3(TD-) X5.4(RD+) X5.5(RD-) X5.6(CR)

### Notes on the sheet
- PHY connectors
- VUT FEKT UTKO
- Powerline devboard QCA7500
- Aleš Ryška

## Sheet 10 of 11: RF - Antennas
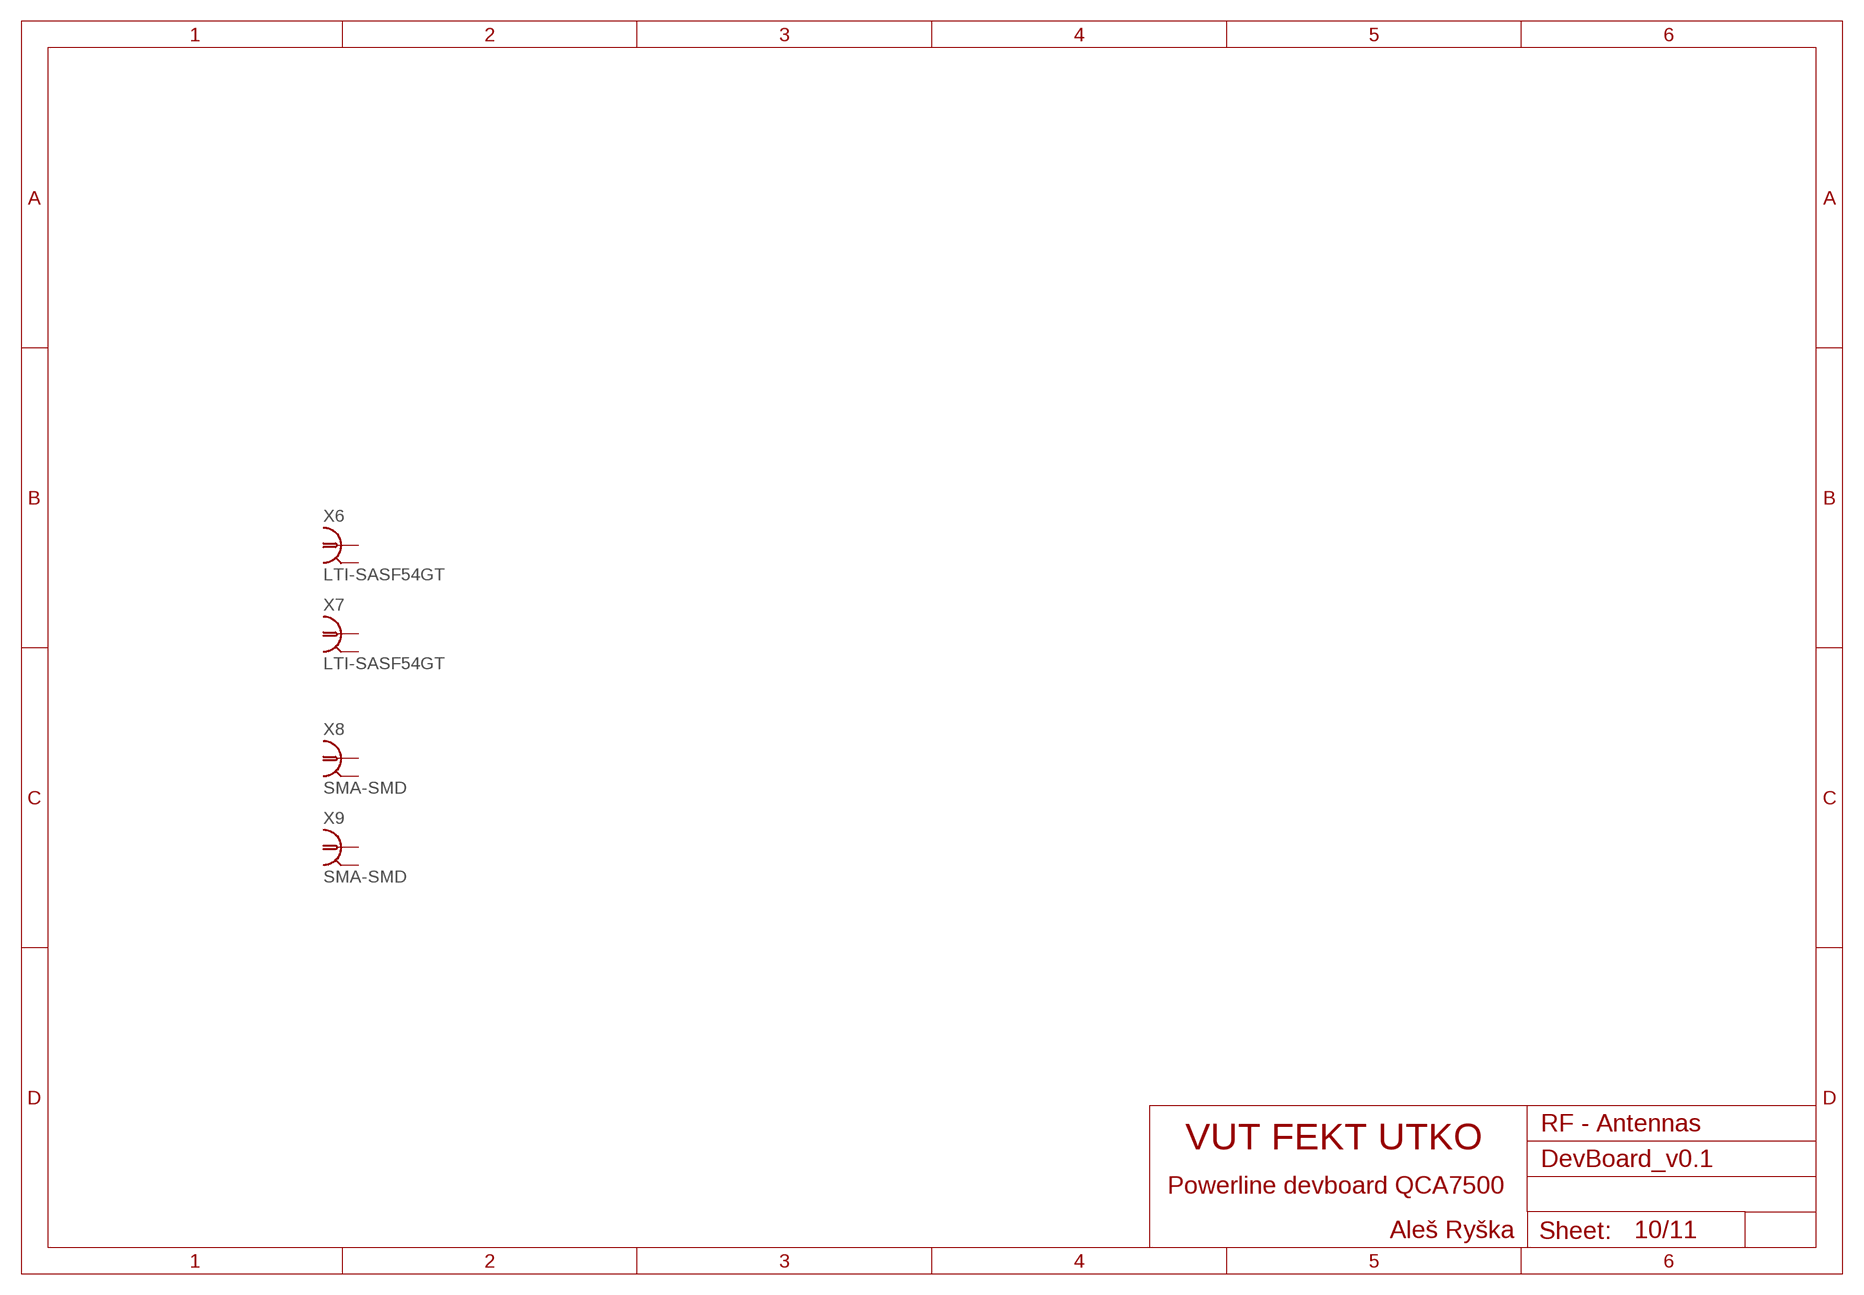
[diagram p9: schematic, sheet 10]

### Parts
X6  LTI-SASF54GT  [LTI-SASF54GT]
X7  LTI-SASF54GT  [LTI-SASF54GT]
X8  SMA-SMD  [SMA-SMD]
X9  SMA-SMD  [SMA-SMD]
Unconnected: X6.1 X6.2 X6.3 X6.4 X6.5 X7.1 X7.2 X7.3 X7.4 X7.5 X8.1 X8.2@1 X8.2@2 X8.2@3 X8.2@4 X8.2@5 X8.2@6 X9.1 X9.2@1 X9.2@2 X9.2@3 X9.2@4 X9.2@5 X9.2@6

### Notes on the sheet
- RF - Antennas
- VUT FEKT UTKO
- Powerline devboard QCA7500
- Aleš Ryška

## Sheet 11 of 11
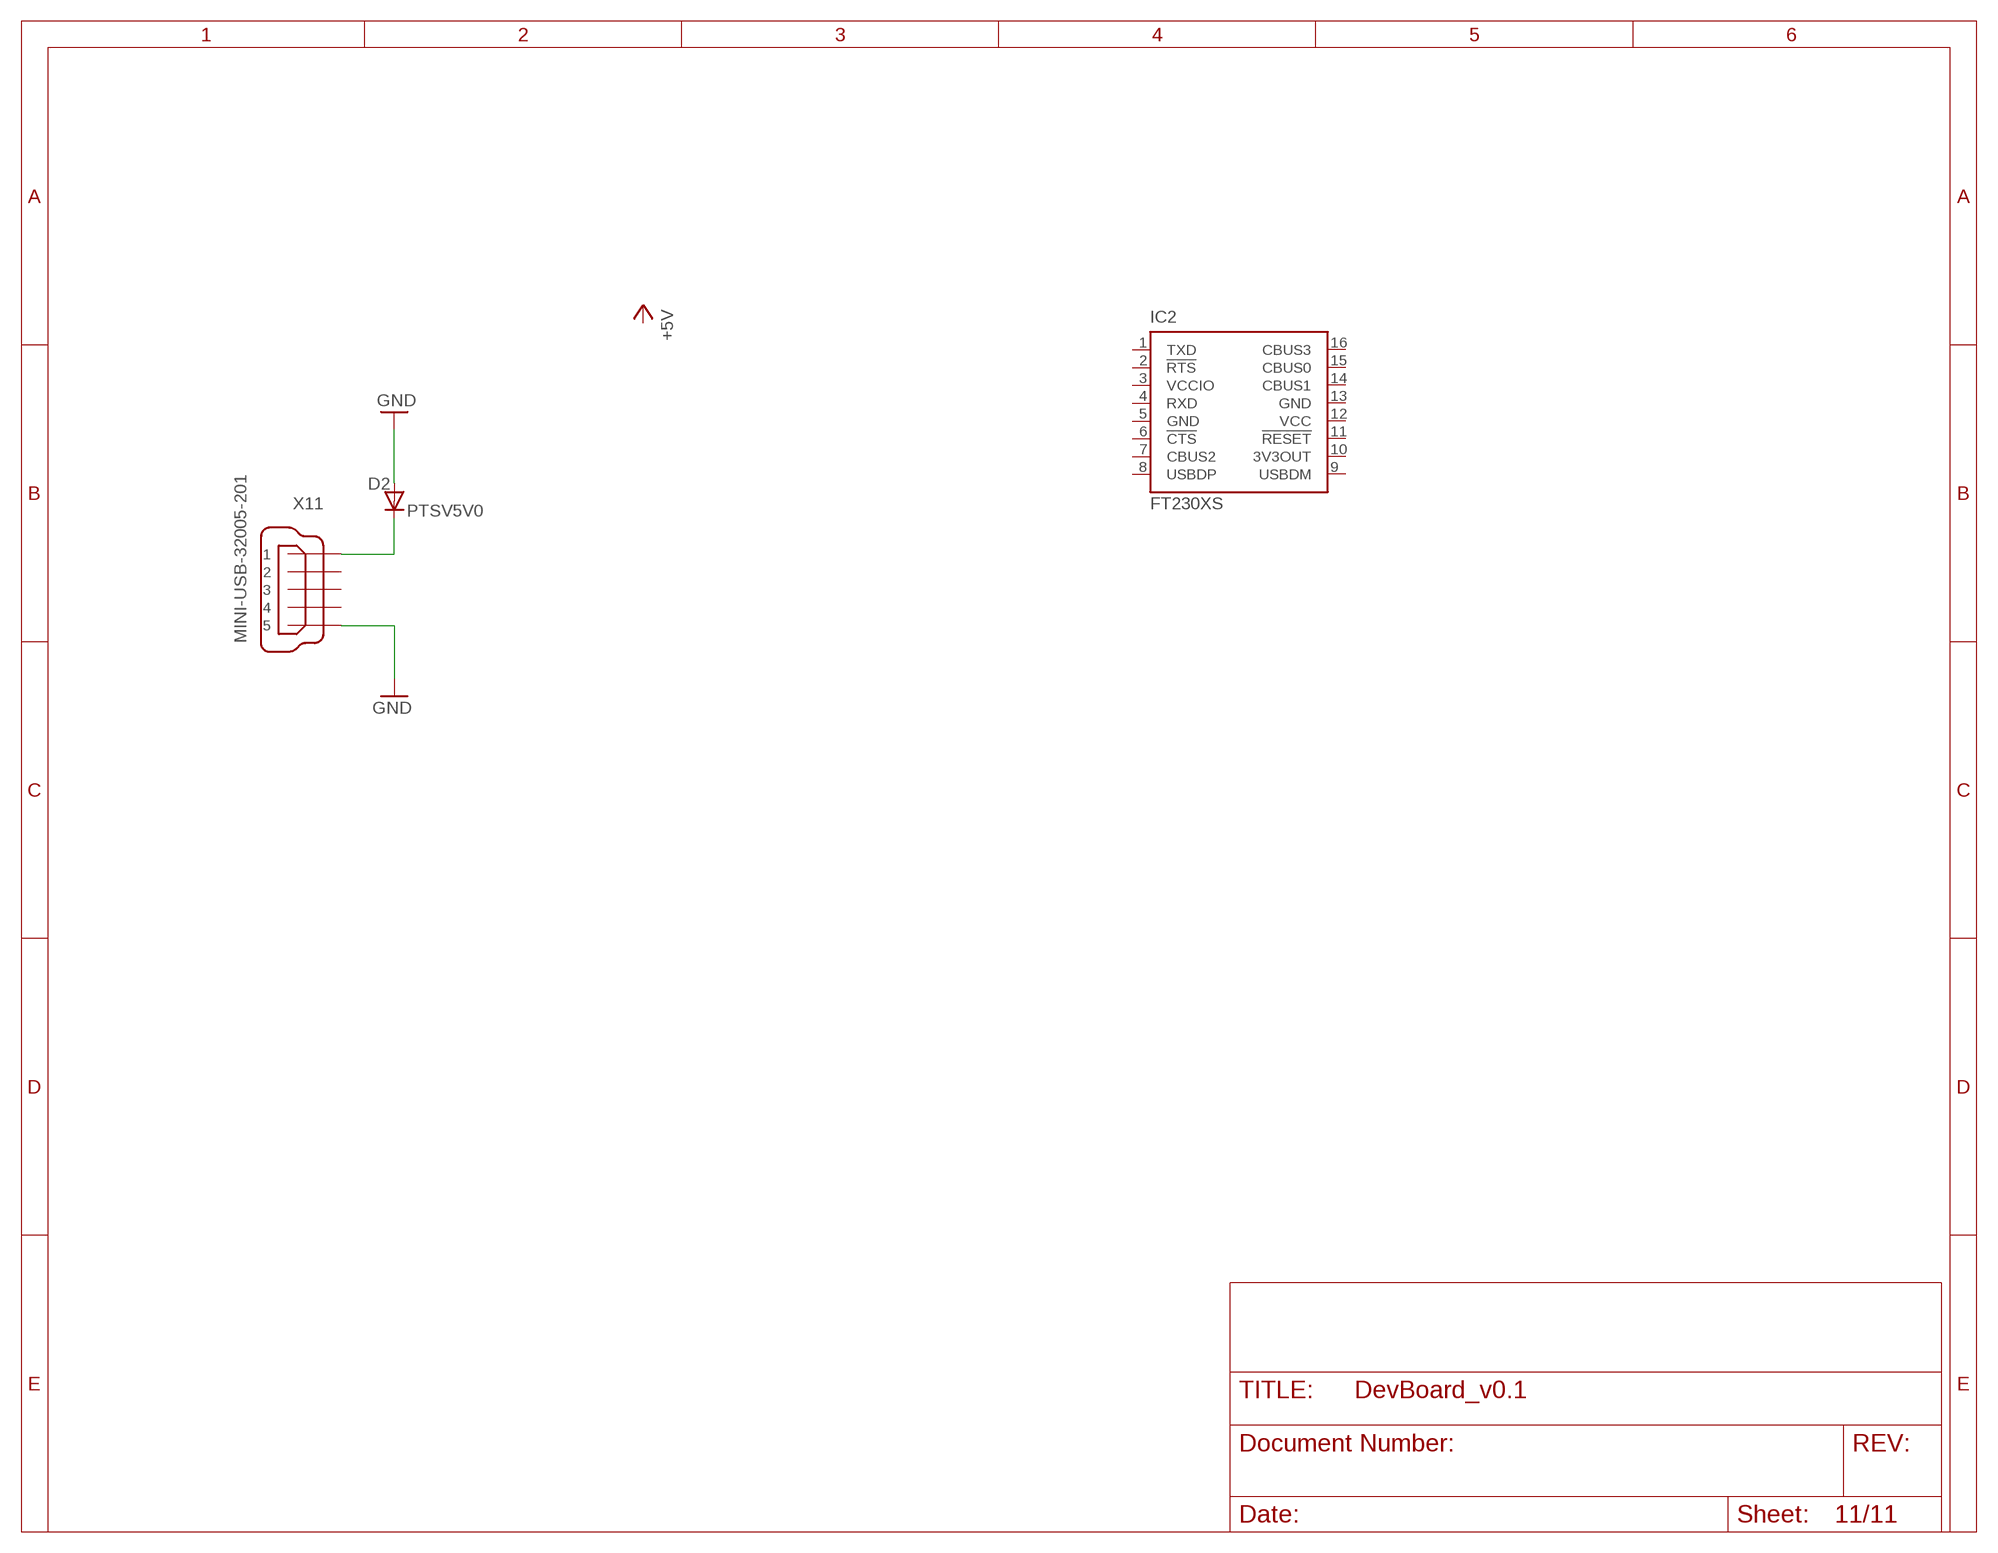
[diagram p10: schematic, sheet 11]

### Parts
D2  PTSV5V0  DIODE-SOD123  [SOD123]
IC2  FT230XS  [SSOP16]
X11  MINI-USB-32005-201  [32005-201]

### Nets
GND: D2.A X11.5 ; also sheet 5,6
N$1: D2.C X11.1
Unconnected: IC2.1(TXD) IC2.2(!RTS) IC2.4(RXD) IC2.6(!CTS) IC2.7(CBUS2) IC2.8(USBDP) IC2.9(USBDM) IC2.10(3V3OUT) IC2.11(!RESET) IC2.14(CBUS1) IC2.15(CBUS0) IC2.16(CBUS3) X11.2 X11.3 X11.4

## Power pins joined to a net without a drawn wire
+3V3: MOD1.25(_POWER:+3V3)
AVDDH1: U3.1(AVDDH1)
AVDDH2: U3.12(AVDDH2)
AVDDL1: U3.4(AVDDL1)
AVDDL2: U3.9(AVDDL2)
AVDDL_PLL: U3.44(AVDDL_PLL)
DDR_VDD: MOD1.12(_POWER:DDR_VDD)
DVDD25_33: MOD1.45(_POWER:DVDD25_33)
DVDDH1: U3.16(DVDDH1)
DVDDH2: U3.34(DVDDH2)
DVDDH3: U3.40(DVDDH3)
DVDDL1: U3.14(DVDDL1)
DVDDL2: U3.18(DVDDL2)
DVDDL3: U3.23(DVDDL3)
DVDDL4: U3.30(DVDDL4)
DVDDL5: U3.26(DVDDL5)
DVDDL6: U3.39(DVDDL6)
GND: IC2.5(GND) IC2.13(GND) MOD1.2(_POWER:GND) MOD1.3(_POWER:GND) MOD1.4(_POWER:GND) MOD1.10(_POWER:GND) MOD1.11(_POWER:GND) MOD1.13(_POWER:GND) MOD1.24(_POWER:GND)
P_GND: U3.49(P_GND)
TH: MOD1.TH1(_POWER:TH) MOD1.TH2(_POWER:TH) MOD1.TH3(_POWER:TH) MOD1.TH4(_POWER:TH) MOD1.TH5(_POWER:TH) MOD1.TH6(_POWER:TH) MOD1.TH7(_POWER:TH) MOD1.TH8(_POWER:TH) MOD1.TH9(_POWER:TH) MOD1.TH10(_POWER:TH) MOD1.TH11(_POWER:TH) MOD1.TH12(_POWER:TH) MOD1.TH13(_POWER:TH) MOD1.TH14(_POWER:TH) MOD1.TH15(_POWER:TH) MOD1.TH16(_POWER:TH) MOD1.TH17(_POWER:TH) MOD1.TH18(_POWER:TH) MOD1.TH19(_POWER:TH) MOD1.TH20(_POWER:TH) MOD1.TH21(_POWER:TH) MOD1.TH22(_POWER:TH) MOD1.TH23(_POWER:TH) MOD1.TH24(_POWER:TH) MOD1.TH25(_POWER:TH)
VCC: IC2.12(VCC) U2.8(VCC)
VCCIO: IC2.3(VCCIO)
VDD: IC1.11(VDD) IC1.28(VDD) IC1.50(VDD) IC1.75(VDD) IC1.100(VDD) MOD1.9(_POWER:VDD)
VDDA: IC1.22(VDDA)
VSS: IC1.10(VSS) IC1.27(VSS) IC1.49(VSS) IC1.74(VSS) IC1.99(VSS) U3.29(VSS)
VSSA: IC1.19(VSSA)

## Library data of the parts
C1-C12 = resistor:C-EU: CAPACITOR, European symbol
C13-C20 = rcl:C-EU: CAPACITOR, European symbol; SPICEPREFIX: C
D1 D2 = diode:DIODE-: DIODE
IC1 = stm32xx:STM32L15*E: STM32L1_Med_density_LQFP100 edit this description Auto generated by make-symbol-device-package-bsdl.ulp Rev. 44 Source: STM32L1_Med_density_LQFP100.bsd
IC2 = ftdichip:FT230X: USB to BASIC UART IC Auto generated by make-symbol-device-package-bsdl.ulp Rev. 43 Source: Data sheet <http://www.ftdichip.com/Support/Documents/DataSheets/ICs/DS_FT230X.pdf>
LED1-LED6 = eagle-ltspice:LED_E: LED Source: http://www.osram.convergy.de Source: www.luxeon.com Source: www.kingbright.com; SPICEMODEL: NONE; SPICEPREFIX: D; SPICETYPE: diode
MOD1 = plc_stamp_1200_micro:PLC_STAMP_1200_MICRO: I2SE PLC Stamp 1200 micro Ordercode: I2PLCCMC-CXL-001
R1-R11 = rcl:R-EU_: RESISTOR, European symbol; SPICEPREFIX: R
S1 S2 = switch:SKHMP*E010: 6.2 X 6.5mm TACT Switch (SMD) Source: http://www3.alps.co.jp/WebObjects/catalog.woa/PDF/E/Switch/Tact/SKHM/SKHM.PDF
U2 = SN65HVD10D:SN65HVD10D: 3.3-V RS-485 TRANSCEIVERS; AVAILABILITY: Unavailable; DESCRIPTION: Line Transceiver 1TR 1 Transceiver 1 Receiver 8-Pin SOIC Tube; MF: Texas Instruments; MP: SN65HVD10D; PACKAGE: SOIC-8 Texas Instruments; PRICE: None
U3 = KSZ9031RNXCA-TR:KSZ9031RNXCA-TR: Ethernet TXRX Single Chip 1.8V/2.5V/3.3V 10Mbps/100Mbps/1000Mbps; AVAILABILITY: Good; DESCRIPTION: Ethernet TXRX Single Chip 1.8V/2.5V/3.3V 10Mbps/100Mbps/1000Mbps; MF: Microchip; MP: KSZ9031RNXCA-TR; PACKAGE: QFN-48 Microchip; PRICE: 4.33 USD
U$1 = jalapeno:JALAPENO
U$2 = SOP65P280X145-8N:TCAN330
U$3 = TPS54719:TPS54719
U$5 = DFN8G-0.5-2X2MM:MIC23150
U$6 = SRN8040:SRN8040
X1 X2 = con-amp:USB-787616: AMP connector
X3 = con-cypressindustries:MINI-USB_SHIELD4P-: MINI USB 4 Pol. Source: www.cypressindustries.com; OC_FARNELL: unknown; OC_NEWARK: unknown
X4 X5 = con-pulse:JP006821U: PULSEJACK (TM) 1x1 Tab-UP RJ45 10/100 Base-TX RJ45 1x1 Tab-UP with LEDs 8-pin (J1 series) and 6-pin (JP series) integrated magnetics connector, designed to support applications, such as ADSL modems, LAN-on-Motherboard, and Hub and Switches. Source: www.pulseeng.com .. PulseJack-J402.pdf; OC_FARNELL: unknown; OC_NEWARK: unknown
X6 X7 = con-coax:LTI-SASF54GT: SMA vertical PCB thrue hole jack Source: Lighthorse Technologies, inc. SASF54GT.pdf; OC_FARNELL: unknown; OC_NEWARK: unknown
X8 X9 = con-coax:SMA-SMD: SMA 50 Ohm Straight Jack Receptacle - Surface Mount www.johnsoncomponents.com Source: http://catalog.digikey.com .. 142-0711-201, 205, 202, 206.pdf; OC_FARNELL: unknown; OC_NEWARK: unknown
X10 X11 = con-cypressindustries:MINI-USB-: MINI USB-B Conector Source: www.cypressindustries.com; OC_FARNELL: unknown; OC_NEWARK: unknown